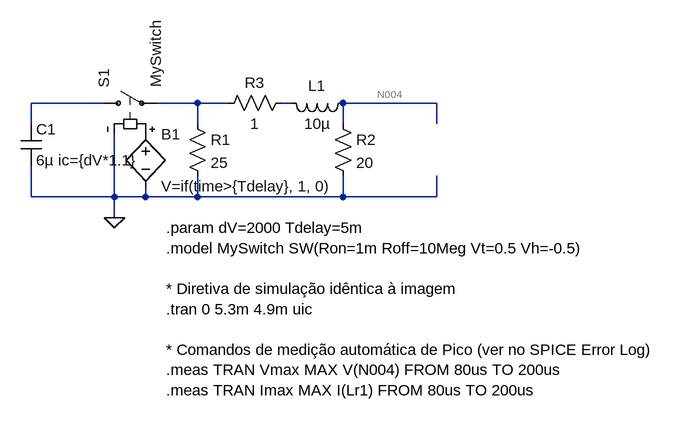
[diagram p0: schematic Draft1.asc]
Draft1.asc, the LTspice schematic file:
Version 4.1
SHEET 1 908 680
WIRE -208 -80 -320 -80
WIRE -64 -80 -128 -80
WIRE -16 -80 -64 -80
WIRE 80 -80 64 -80
WIRE 304 -80 160 -80
WIRE -320 -48 -320 -80
WIRE -64 -48 -64 -80
WIRE 160 -48 160 -80
WIRE 304 -48 304 -80
WIRE -320 64 -320 16
WIRE -192 64 -192 -32
WIRE -192 64 -320 64
WIRE -144 64 -144 48
WIRE -144 64 -192 64
WIRE -64 64 -64 32
WIRE -64 64 -144 64
WIRE 160 64 160 32
WIRE 160 64 -64 64
WIRE 304 64 304 32
WIRE 304 64 160 64
WIRE -192 96 -192 64
FLAG -192 96 0
SYMBOL cap -336 -48 R0
SYMATTR InstName C1
SYMATTR Value 6µ ic={dV*1.1}
SYMBOL res -80 -64 R0
SYMATTR InstName R1
SYMATTR Value 25
SYMBOL res 144 -64 R0
SYMATTR InstName R2
SYMATTR Value 20
SYMBOL res 80 -96 R90
WINDOW 0 0 56 VBottom 2
WINDOW 3 32 56 VTop 2
SYMATTR InstName R3
SYMATTR Value 1
SYMBOL ind 176 -96 R90
WINDOW 0 5 56 VBottom 2
WINDOW 3 32 56 VTop 2
SYMATTR InstName L1
SYMATTR Value 10µ
SYMATTR SpiceLine Rser=1m
SYMBOL sw -224 -80 R270
SYMATTR InstName S1
SYMATTR Value MySwitch
SYMBOL bv -144 -48 R0
SYMATTR InstName B1
SYMATTR Value V=if(time>{Tdelay}, 1, 0)
TEXT -112 112 Left 2 !.param dV=2000 Tdelay=5m\n.model MySwitch SW(Ron=1m Roff=10Meg Vt=0.5 Vh=-0.5)\n \n* Diretiva de simulação idêntica à imagem\n.tran 0 5.3m 4.9m uic\n \n* Comandos de medição automática de Pico (ver no SPICE Error Log)\n.meas TRAN Vmax MAX V(N004) FROM 80us TO 200us\n.meas TRAN Imax MAX I(Lr1) FROM 80us TO 200us

The netlist it stands for:
* Draft1.asc
C1 N001 0 6µ ic={dV*1.1}
R1 N002 0 25
R2 N004 0 20
R3 N003 N002 1
L1 N004 N003 10µ Rser=1m
S1 N001 N002 P001 0 MySwitch
B1 P001 0 V=if(time>{Tdelay}, 1, 0)
.param dV=2000 Tdelay=5m
.model MySwitch SW(Ron=1m Roff=10Meg Vt=0.5 Vh=-0.5)
* Diretiva de simulação idêntica à imagem
.tran 0 5.3m 4.9m uic
* Comandos de medição automática de Pico (ver no SPICE Error Log)
.meas TRAN Vmax MAX V(N004) FROM 80us TO 200us
.meas TRAN Imax MAX I(Lr1) FROM 80us TO 200us
.backanno
.end